# Altium project GB_EtherCan_Hardware.PrjPcb
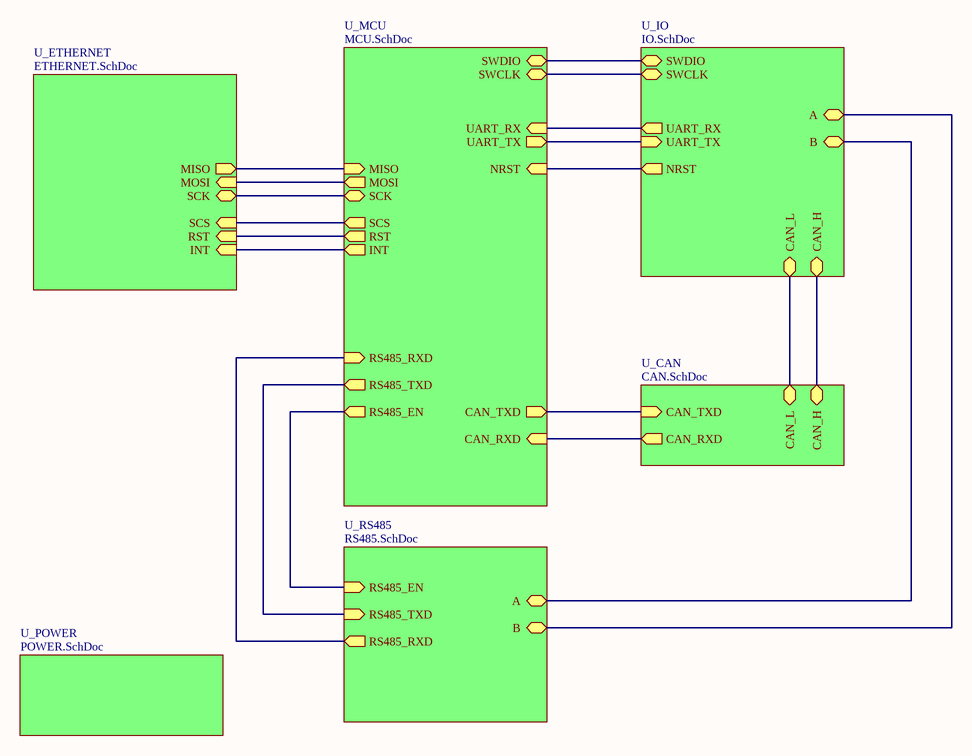
[diagram p0: Main.SchDoc]
7 sheets, 120 parts. Net scope: hierarchical (ports join the sheet entries above them; power ports are global).
Board file: GB_EtherCan.PcbDoc
Sheets:
  Main.SchDoc
    U_CAN = CAN.SchDoc
    U_MCU = MCU.SchDoc
    U_IO = IO.SchDoc
    U_ETHERNET = ETHERNET.SchDoc
    U_POWER = POWER.SchDoc
    U_RS485 = RS485.SchDoc

## Sheet Main.SchDoc
size A

### Sub-sheets
U_CAN = CAN.SchDoc: CAN_TXD (in), CAN_RXD (out), CAN_H (bidir), CAN_L (bidir)
U_ETHERNET = ETHERNET.SchDoc: RST (in), INT (in), SCS (in), SCK (bidir), MISO (out), MOSI (in)
U_IO = IO.SchDoc: SWDIO (bidir), SWCLK (bidir), UART_TX (in), UART_RX (out), CAN_H (bidir), CAN_L (bidir), NRST (out), A (bidir), B (bidir)
U_MCU = MCU.SchDoc: SWDIO (bidir), SWCLK (bidir), UART_RX (in), UART_TX (out), SCK (bidir), MISO (in), MOSI (out), SCS (out), RST (out), INT (out), CAN_TXD (out), CAN_RXD (in), NRST (in), RS485_RXD (in), RS485_TXD (out), RS485_EN (out)
U_POWER = POWER.SchDoc: no entries
U_RS485 = RS485.SchDoc: RS485_RXD (out), RS485_TXD (in), RS485_EN (in), A (bidir), B (bidir)

### Nets
A: sheet U_IO/B, sheet U_RS485/A
B: sheet U_IO/A, sheet U_RS485/B
CAN_N: sheet U_CAN/CAN_L, sheet U_IO/CAN_L
CAN_P: sheet U_CAN/CAN_H, sheet U_IO/CAN_H
CAN_RXD: sheet U_CAN/CAN_RXD, sheet U_MCU/CAN_RXD
CAN_TXD: sheet U_CAN/CAN_TXD, sheet U_MCU/CAN_TXD
JTCK SWCLK PA14: sheet U_MCU/SWCLK, sheet U_IO/SWCLK
JTMS SWDIO PA13: sheet U_MCU/SWDIO, sheet U_IO/SWDIO
NRST: sheet U_MCU/NRST, sheet U_IO/NRST
NetR17_1: sheet U_MCU/INT, sheet U_ETHERNET/INT
NetR18_1: sheet U_MCU/MOSI, sheet U_ETHERNET/MOSI
NetR19_1: sheet U_MCU/MISO, sheet U_ETHERNET/MISO
NetR23_1: sheet U_MCU/SCK, sheet U_ETHERNET/SCK
NetR24_1: sheet U_MCU/SCS, sheet U_ETHERNET/SCS
NetR41_1: sheet U_MCU/RST, sheet U_ETHERNET/RST
NetR42_1: sheet U_MCU/RS485_RXD, sheet U_RS485/RS485_RXD
NetR45_1: sheet U_MCU/RS485_EN, sheet U_RS485/RS485_EN
NetU2_4: sheet U_MCU/RS485_TXD, sheet U_RS485/RS485_TXD
NetU3_21: sheet U_MCU/UART_TX, sheet U_IO/UART_TX
NetU3_22: sheet U_MCU/UART_RX, sheet U_IO/UART_RX

## Sheet CAN.SchDoc
size A
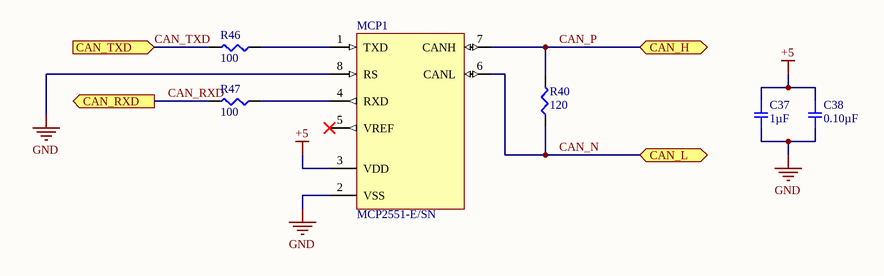
[diagram p1: CAN.SchDoc]

### Parts
C37  1µF  [0805]
C38  0.10µF  [0805]
MCP1  MCP2551-E/SN  [SOIC-SN8_N]
R40  120  [0805]
R46  100  [0805]
R47  100  [0805]

### Ports
CAN_H (bidir), CAN_L (bidir), CAN_RXD (out), CAN_TXD (in)

### Nets
+5: C37.1 C38.1 MCP1.3(VDD)
GND: C37.2 C38.2 MCP1.2(VSS) MCP1.8(RS)
CAN_N: MCP1.6(CANL) R40.1 ; port CAN_L
CAN_P: MCP1.7(CANH) R40.2 ; port CAN_H
CAN_RXD: R47.2 ; port CAN_RXD
CAN_TXD: R46.2 ; port CAN_TXD
NetMCP1_1: MCP1.1(TXD) R46.1
NetMCP1_4: MCP1.4(RXD) R47.1

Not connected (* = marked no-connect by the designer): MCP1 5(VREF)*

### Library data of the parts
C37 = GCM219R71C105KA37J: CAP CER 1.0UF 16V X7R 0805; Manufacturer: Murata Electronics North America; Factory Stock: 0; Unit Price (USD): 0.17; Minimum Quantity: 1; Tolerance: ±10%; Datasheets: http://www.murata.com/~/media/webrenewal/support/library/catalog/products/capacitor/mlcc/c03e.ashx; Image: //media.digikey.com/photos/Murata%20Photos/NCP,GCM%20SERIES%200805.jpg; Digi-Key Part Number: 490-12590-1-ND; Part Number: GCM219R71C105KA37J; Quantity Available: 7483; @ qty: 0; Packaging: Cut Tape (CT); Series: GCM; Part Status: Active; Value: 1µF; Voltage: 16V; Temperature Coefficient: X7R; Operating Temperature: -55°C ~ 125°C; Features: -; Ratings: AEC-Q200; Applications: Automotive; Mounting Type: Surface Mount, MLCC; Package / Case: 0805 (2012 Metric); Size / Dimension: 0.079" L x 0.049" W (2.00mm x 1.25mm); Height - Seated (Max): 0.037" (0.95mm); Thickness (Max): -; Lead Spacing: -
C38 = GRM219R71E104KA01D: CAP CER 0.1UF 25V X7R 0805; Manufacturer: Murata Electronics North America; Factory Stock: 0; Unit Price (USD): 0.12; Minimum Quantity: 1; Tolerance: ±10%; Datasheets: http://www.murata.com/~/media/webrenewal/support/library/catalog/products/capacitor/mlcc/c02e.pdf; Image: //media.digikey.com/Renders/Murata%20Renders/0805%20(2012%20Metric)%20.85mm.jpg; Digi-Key Part Number: 490-12754-1-ND; Part Number: GRM219R71E104KA01D; Quantity Available: 8594; @ qty: 0; Packaging: Cut Tape (CT); Series: GRM; Part Status: Active; Value: 0.10µF; Voltage: 25V; Temperature Coefficient: X7R; Operating Temperature: -55°C ~ 125°C; Features: -; Ratings: -; Applications: General Purpose; Mounting Type: Surface Mount, MLCC; Package / Case: 0805 (2012 Metric); Size / Dimension: 0.079" L x 0.049" W (2.00mm x 1.25mm); Height - Seated (Max): -; Thickness (Max): 0.037" (0.95mm); Lead Spacing: -; Lead Style: -
MCP1 = MCP2551-E/SN: High-Speed CAN Transceiver, 8-Pin SOIC, Extended Temperature; Manufacturer: Microchip; DatasheetVersion: revF, Jul-2010; PackageVersion: revBB, Aug-2009; PackageReference: SOIC-SN8; PackageDescription: 8-Lead Plastic Small Outline (SN) - Narrow, 3.90mm Body [SOIC]; Supplier 1: Digi-Key; Supplier Part Number 1: MCP2551-E/SN-ND; Supplier 2: Farnell; Supplier Part Number 2: 1467746; Supplier 3: Newark; Supplier Part Number 3: 92C4186; Supplier 4: Mouser; Supplier Part Number 4: 579-MCP2551-E/SN; Mounting Technology: Surface Mount; Code_JEDEC: MS-012; Code_IPC: SOIC127P600-8; PartNumber: MCP2551-E/SN; ComponentLink1Description: Manufacturer URL; ComponentLink1URL: http://www.microchip.com/; ComponentLink2Description: Datasheet; ComponentLink2URL: http://ww1.microchip.com/downloads/en/DeviceDoc/21667F.pdf; ComponentLink3Description: Package Specification; ComponentLink3URL: http://www.microchip.com/stellent/groups/techpub_sg/documents/packagingspec/en012702.pdf
R40 = ERJ-6GEYJ121V: RES SMD 120 OHM 5% 1/8W 0805; Manufacturer: Panasonic Electronic Components; Factory Stock: 0; Unit Price (USD): 0.00496; @ qty: 1500; Minimum Quantity: 1; Power (Watts): 0.125W, 1/8W; Temperature Coefficient: ±200ppm/°C; Part Number: ERJ-6GEYJ121V; Datasheets: http://industrial.panasonic.com/www-cgi/jvcr13pz.cgi?E+PZ+3+AOA0001+ERJ6GEYJ121V+7+WW; Image: //media.digikey.com/Renders/Panasonic%20Renders/ERJ-0805%20Pkg.jpg; Digi-Key Part Number: P120ACT-ND; Quantity Available: 58156; Packaging: Cut Tape (CT); Series: ERJ; Part Status: Active; Value: 120; Tolerance: ±5%; Composition: Thick Film; Features: Automotive AEC-Q200; Operating Temperature: -55°C ~ 155°C; Package / Case: 0805 (2012 Metric); Supplier Device Package: 0805; Size / Dimension: 0.079" L x 0.049" W (2.00mm x 1.25mm); Height - Seated (Max): 0.028" (0.70mm); Number of Terminations: 2; Failure Rate: -
R46 R47 = ERJ-6GEYJ121V: RES SMD 120 OHM 5% 1/8W 0805; Manufacturer: Panasonic Electronic Components; Factory Stock: 0; Unit Price (USD): 0.00496; @ qty: 1500; Minimum Quantity: 1; Value: 120; Power (Watts): 0.125W, 1/8W; Temperature Coefficient: ±200ppm/°C; Part Number: ERJ-6GEYJ121V; Datasheets: http://industrial.panasonic.com/www-cgi/jvcr13pz.cgi?E+PZ+3+AOA0001+ERJ6GEYJ121V+7+WW; Image: //media.digikey.com/Renders/Panasonic%20Renders/ERJ-0805%20Pkg.jpg; Digi-Key Part Number: P120ACT-ND; Quantity Available: 58156; Packaging: Cut Tape (CT); Series: ERJ; Part Status: Active; Tolerance: ±5%; Composition: Thick Film; Features: Automotive AEC-Q200; Operating Temperature: -55°C ~ 155°C; Package / Case: 0805 (2012 Metric); Supplier Device Package: 0805; Size / Dimension: 0.079" L x 0.049" W (2.00mm x 1.25mm); Height - Seated (Max): 0.028" (0.70mm); Number of Terminations: 2; Failure Rate: -

## Sheet MCU.SchDoc
size A
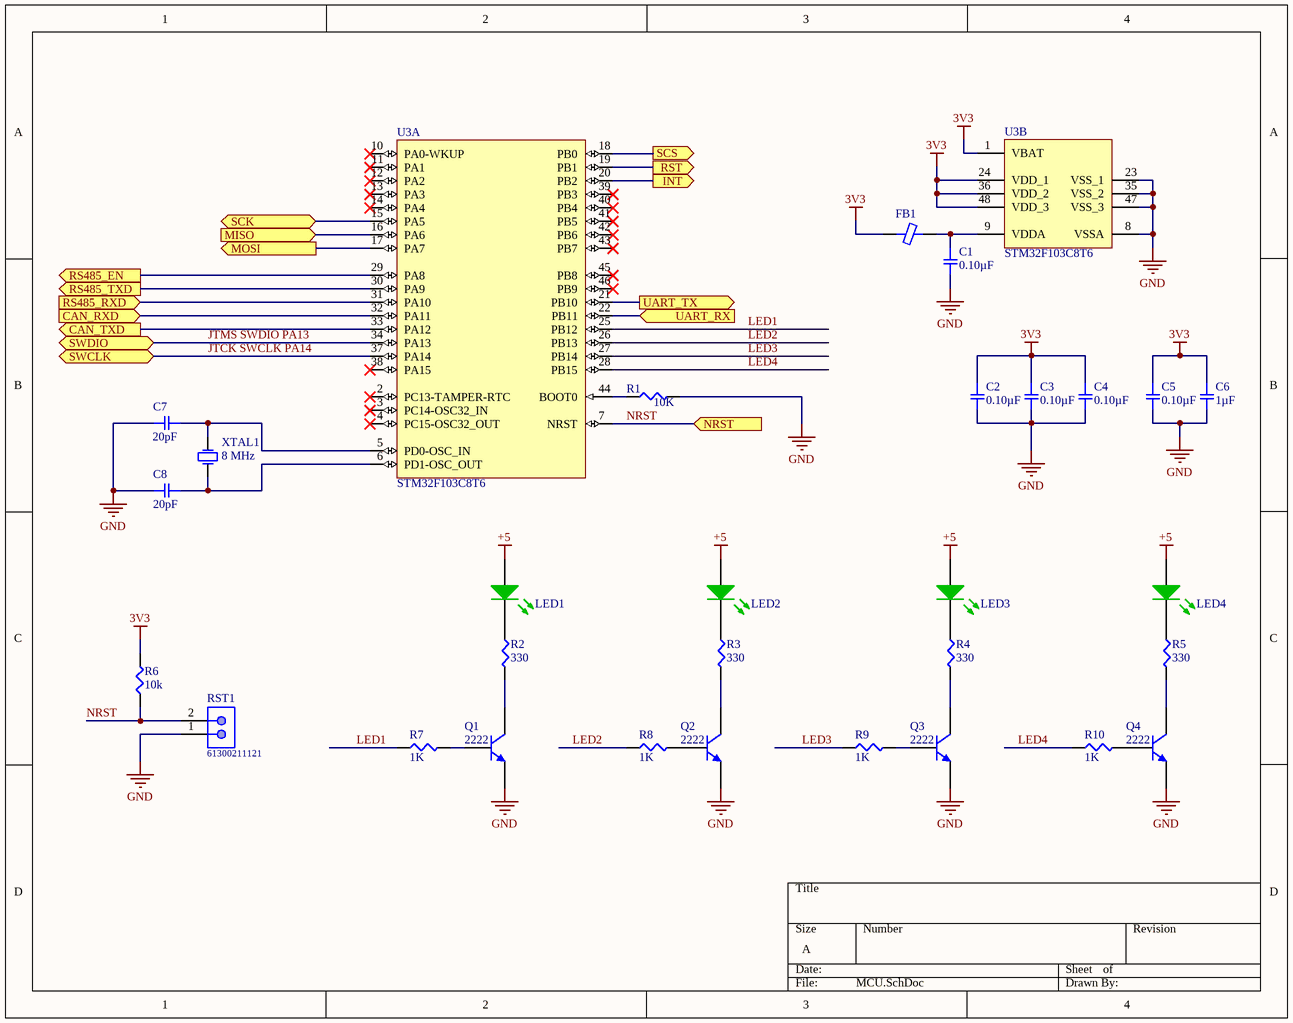
[diagram p2: MCU.SchDoc]

### Parts
C1  0.10µF  [0805]
C2  0.10µF  [0805]
C3  0.10µF  [0805]
C4  0.10µF  [0805]
C5  0.10µF  [0805]
C6  1µF  [0805]
C7  20pF  [0805]
C8  20pF  [0805]
FB1  (no value)  [0805]
LED1  LED-GREEN  [DIOSMD1206]  (value not drawn)
LED2  LED-GREEN  [DIOSMD1206]  (value not drawn)
LED3  LED-GREEN  [DIOSMD1206]  (value not drawn)
LED4  LED-GREEN  [DIOSMD1206]  (value not drawn)
Q1  2222  [SOT23-3]
Q2  2222  [SOT23-3]
Q3  2222  [SOT23-3]
Q4  2222  [SOT23-3]
R1  10K  [0805]
R2  330  [0805]
R3  330  [0805]
R4  330  [0805]
R5  330  [0805]
R6  10k  [0805]
R7  1K  [0805]
R8  1K  [0805]
R9  1K  [0805]
R10  1K  [0805]
RST1  61300211121  [61300211121]
U3  STM32F103C8T6  [STM-LQFP48_N]  (parts A,B of 2)
XTAL1  8 MHz  [CRYSTAL Small]

### Ports
CAN_RXD (in), CAN_TXD (out), INT (out), MISO (in), MOSI (out), NRST (in), RS485_EN (out), RS485_RXD (in), RS485_TXD (out), RST (out), SCK (bidir), SCS (out), SWCLK (bidir), SWDIO (bidir), UART_RX (in), UART_TX (out)

### Nets
3V3: C2.1 C3.1 C4.1 C5.1 C6.1 FB1.1 R6.2 U3.1(VBAT) U3.24(VDD_1) U3.36(VDD_2) U3.48(VDD_3)
+5: LED1.1(A) LED2.1(A) LED3.1(A) LED4.1(A)
GND: C1.2 C2.2 C3.2 C4.2 C5.2 C6.2 C7.2 C8.2 Q1.2(E) Q2.2(E) Q3.2(E) Q4.2(E) R1.2 RST1.1 U3.8(VSSA) U3.23(VSS_1) U3.35(VSS_2) U3.47(VSS_3)
CAN_RXD: U3.32(PA11) ; port CAN_RXD
CAN_TXD: U3.33(PA12) ; port CAN_TXD
JTCK SWCLK PA14: U3.37(PA14) ; port SWCLK
JTMS SWDIO PA13: U3.34(PA13) ; port SWDIO
LED1: R7.1 U3.25(PB12)
LED2: R8.1 U3.26(PB13)
LED3: R9.1 U3.27(PB14)
LED4: R10.1 U3.28(PB15)
NRST: R6.1 RST1.2 U3.7(NRST) ; port NRST
NetC1_1: C1.1 FB1.2 U3.9(VDDA)
NetC7_1: C7.1 U3.5(PD0-OSC_IN) XTAL1.2(OSC2)
NetC8_1: C8.1 U3.6(PD1-OSC_OUT) XTAL1.1(OSC1)
NetLED1_2: LED1.2(K) R2.1
NetLED2_2: LED2.2(K) R3.1
NetLED3_2: LED3.2(K) R4.1
NetLED4_2: LED4.2(K) R5.1
NetQ1_1: Q1.1(B) R7.2
NetQ1_3: Q1.3(C) R2.2
NetQ2_1: Q2.1(B) R8.2
NetQ2_3: Q2.3(C) R3.2
NetQ3_1: Q3.1(B) R9.2
NetQ3_3: Q3.3(C) R4.2
NetQ4_1: Q4.1(B) R10.2
NetQ4_3: Q4.3(C) R5.2
NetR1_1: R1.1 U3.44(BOOT0)
NetR17_1: U3.20(PB2) ; port INT
NetR18_1: U3.17(PA7) ; port MOSI
NetR19_1: U3.16(PA6) ; port MISO
NetR23_1: U3.15(PA5) ; port SCK
NetR24_1: U3.18(PB0) ; port SCS
NetR41_1: U3.19(PB1) ; port RST
NetR42_1: U3.31(PA10) ; port RS485_RXD
NetR45_1: U3.29(PA8) ; port RS485_EN
NetU2_4: U3.30(PA9) ; port RS485_TXD
NetU3_21: U3.21(PB10) ; port UART_TX
NetU3_22: U3.22(PB11) ; port UART_RX

Not connected (* = marked no-connect by the designer): U3 2(PC13-TAMPER-RTC)* 3(PC14-OSC32_IN)* 4(PC15-OSC32_OUT)* 10(PA0-WKUP)* 11(PA1)* 12(PA2)* 13(PA3)* 14(PA4)* 38(PA15)* 39(PB3)* 40(PB4)* 41(PB5)* 42(PB6)* 43(PB7)* 45(PB8)* 46(PB9)*

### Library data of the parts
C1-C5 = GRM219R71E104KA01D: as C38 on sheet CAN; Datasheets: http://www.murata.com/~/media/webrenewal/support/library/catalog/products/capacitor/mlcc/c02e.pdf; Image: //media.digikey.com/Renders/Murata%20Renders/0805%20(2012%20Metric)%20.85mm.jpg; Digi-Key Part Number: 490-12754-1-ND; Part Number: GRM219R71E104KA01D; Quantity Available: 8594; @ qty: 0; Packaging: Cut Tape (CT); Series: GRM; Part Status: Active; Value: 0.10µF; Voltage: 25V; Temperature Coefficient: X7R; Operating Temperature: -55°C ~ 125°C; Features: -; Ratings: -; Applications: General Purpose; Mounting Type: Surface Mount, MLCC; Package / Case: 0805 (2012 Metric); Size / Dimension: 0.079" L x 0.049" W (2.00mm x 1.25mm); Height - Seated (Max): -; Thickness (Max): 0.037" (0.95mm); Lead Spacing: -; Lead Style: -
C6 = GCM219R71C105KA37J: as C37 on sheet CAN; Datasheets: http://www.murata.com/~/media/webrenewal/support/library/catalog/products/capacitor/mlcc/c03e.ashx; Image: //media.digikey.com/photos/Murata%20Photos/NCP,GCM%20SERIES%200805.jpg; Digi-Key Part Number: 490-12590-1-ND; Part Number: GCM219R71C105KA37J; Quantity Available: 7483; @ qty: 0; Packaging: Cut Tape (CT); Series: GCM; Part Status: Active; Value: 1µF; Voltage: 16V; Temperature Coefficient: X7R; Operating Temperature: -55°C ~ 125°C; Features: -; Ratings: AEC-Q200; Applications: Automotive; Mounting Type: Surface Mount, MLCC; Package / Case: 0805 (2012 Metric); Size / Dimension: 0.079" L x 0.049" W (2.00mm x 1.25mm); Height - Seated (Max): 0.037" (0.95mm); Thickness (Max): -; Lead Spacing: -
C7 C8 = GQM2195C1H200JB01D: CAP CER 20PF 50V NP0 0805; Manufacturer: Murata Electronics North America; Factory Stock: 0; Unit Price (USD): 0.78; Minimum Quantity: 1; Tolerance: ±5%; Temperature Coefficient: C0G, NP0; Datasheets: http://www.murata.com/~/media/webrenewal/support/library/catalog/products/capacitor/mlcc/c02e.pdf; Image: //media.digikey.com/Renders/Murata%20Renders/0805(GxM9).jpg; Digi-Key Part Number: 490-3607-1-ND; Part Number: GQM2195C1H200JB01D; Quantity Available: 270; @ qty: 0; Packaging: Cut Tape (CT); Series: GQM; Part Status: Active; Value: 20pF; Voltage: 50V; Operating Temperature: -55°C ~ 125°C; Features: High Q, Low Loss; Ratings: -; Applications: RF, Microwave, High Frequency; Mounting Type: Surface Mount, MLCC; Package / Case: 0805 (2012 Metric); Size / Dimension: 0.079" L x 0.049" W (2.00mm x 1.25mm); Height - Seated (Max): -; Thickness (Max): 0.037" (0.95mm); Lead Spacing: -; Lead Style: -
FB1 = 2508053007Y3: FERRITE BEAD 0805 1LN; Manufacturer: Fair-Rite Products Corp.; Current Rating (Max): 3A; DC Resistance (DCR) (Max): 30mOhm; Filter Type: Signal Line; Number of Lines: 1; Part Number: 2508053007Y3; ComponentLink1Description: Datasheet; ComponentLink1URL: http://www.fair-rite.com/wp-content/themes/fair-rite/print_product.php?pid=19169; ComponentLink2Description: DigiKey Link; ComponentLink2URL: http://digikey.com/product-detail/en/fair-rite-products-corp/2508053007Y3/1934-1399-1-ND/8594366; Device Package: 0805 (2012 Metric); Height (Max): 0.043" (1.10mm); LastUpdated: 1/21/2020 2:29:10 AM; Lifecycle Status: Active; Minimum Order: 1; Mounting Type: Surface Mount; Operating Temperature: -55°C ~ 125°C; Package / Case: 0805 (2012 Metric); Packaging: TapeAndReel; PartId: 1487; Part Status: Active; Price: 0.02; Series: -; Size / Dimension: 0.079" L x 0.049" W (2.00mm x 1.25mm); Supplier 1: DigiKey; Supplier Part Number 1: 1934-1399-1-ND
LED1-LED4 = LED-GREEN: General Propuse Ga/As LED; Supplier 1: Newark; Supplier 2: Digi-Key; Supplier 3: Mouser; Supplier 4: Farnell; Supplier 5: Mouser; Supplier Part Number 1: 95W3800; Supplier Part Number 2: 160-1423-6-ND; Supplier Part Number 3: 630-HSMM-C170; Supplier Part Number 4: 2322076; Supplier Part Number 5: 604-APT2012SGC
Q1-Q4 = BC817-25: NPN General Purpose Amplifier; Published: 8-Jun-2000; LatestRevisionDate: 20-Nov-2009; LatestRevisionNote: IPC-7351 Footprint Added.; DatasheetVersion: 1997; PackageVersion: Sep-1998; PackageReference: SOT-23A; Publisher: Altium Limited; PackageDescription: 3-Pin SOT-23 Package 0.95 mm Pitch, 2.3 mm Lead Span; ComponentLink1Description: Manufacturer Link; ComponentLink1URL: http://www.fairchildsemi.com/; ComponentLink2Description: Discontinuation Notice; ComponentLink2URL: http://www.fairchildsemi.com/obsolete/obs.jsp; Supplier 1: Mouser; Supplier 2: Digi-Key; Supplier Part Number 1: 863-BC817-25LT1G; Supplier Part Number 2: BC817-25-TPMSDKR-ND
R1 R6 = ERJ-6GEYJ103V: RES SMD 10K OHM 5% 1/8W 0805; Manufacturer: Panasonic Electronic Components; Factory Stock: 0; Unit Price (USD): 0.00496; @ qty: 1500; Minimum Quantity: 1; Power (Watts): 0.125W, 1/8W; Temperature Coefficient: ±200ppm/°C; Part Number: ERJ-6GEYJ103V; Datasheets: http://industrial.panasonic.com/www-cgi/jvcr13pz.cgi?E+PZ+3+AOA0001+ERJ6GEYJ103V+7+WW; Image: //media.digikey.com/Renders/Panasonic%20Renders/ERJ-0805%20Pkg.jpg; Digi-Key Part Number: P10KACT-ND; Quantity Available: 2328224; Packaging: Cut Tape (CT); Series: ERJ; Part Status: Active; Value: 10k; Tolerance: ±5%; Composition: Thick Film; Features: Automotive AEC-Q200; Operating Temperature: -55°C ~ 155°C; Package / Case: 0805 (2012 Metric); Supplier Device Package: 0805; Size / Dimension: 0.079" L x 0.049" W (2.00mm x 1.25mm); Height - Seated (Max): 0.028" (0.70mm); Number of Terminations: 2; Failure Rate: -
R2-R5 = ERJ-6GEYJ331V: RES SMD 330 OHM 5% 1/8W 0805; Manufacturer: Panasonic Electronic Components; Factory Stock: 0; Unit Price (USD): 0.00496; @ qty: 1500; Minimum Quantity: 1; Power (Watts): 0.125W, 1/8W; Temperature Coefficient: ±200ppm/°C; Part Number: ERJ-6GEYJ331V; Datasheets: http://industrial.panasonic.com/www-cgi/jvcr13pz.cgi?E+PZ+3+AOA0001+ERJ6GEYJ331V+7+WW; Image: //media.digikey.com/Renders/Panasonic%20Renders/ERJ-0805%20Pkg.jpg; Digi-Key Part Number: P330ACT-ND; Quantity Available: 212236; Packaging: Cut Tape (CT); Series: ERJ; Part Status: Active; Value: 330; Tolerance: ±5%; Composition: Thick Film; Features: Automotive AEC-Q200; Operating Temperature: -55°C ~ 155°C; Package / Case: 0805 (2012 Metric); Supplier Device Package: 0805; Size / Dimension: 0.079" L x 0.049" W (2.00mm x 1.25mm); Height - Seated (Max): 0.028" (0.70mm); Number of Terminations: 2; Failure Rate: -
R7-R10 = ERJ-6GEYJ331V: RES SMD 330 OHM 5% 1/8W 0805; Manufacturer: Panasonic Electronic Components; Factory Stock: 0; Unit Price (USD): 0.00496; @ qty: 1500; Minimum Quantity: 1; Value: 330; Power (Watts): 0.125W, 1/8W; Temperature Coefficient: ±200ppm/°C; Part Number: ERJ-6GEYJ331V; Datasheets: http://industrial.panasonic.com/www-cgi/jvcr13pz.cgi?E+PZ+3+AOA0001+ERJ6GEYJ331V+7+WW; Image: //media.digikey.com/Renders/Panasonic%20Renders/ERJ-0805%20Pkg.jpg; Digi-Key Part Number: P330ACT-ND; Quantity Available: 212236; Packaging: Cut Tape (CT); Series: ERJ; Part Status: Active; Tolerance: ±5%; Composition: Thick Film; Features: Automotive AEC-Q200; Operating Temperature: -55°C ~ 155°C; Package / Case: 0805 (2012 Metric); Supplier Device Package: 0805; Size / Dimension: 0.079" L x 0.049" W (2.00mm x 1.25mm); Height - Seated (Max): 0.028" (0.70mm); Number of Terminations: 2; Failure Rate: -
RST1 = 61300211121: WR-PHD Pin Header, THT, pitch 2.54mm, Single Row, Vertical, 2pin; Pin Number: 2; Gender: Male; Rated Current: 3A; Working Voltage: 250VAC; Withstanding Voltage: 500VAC; Contact Resistance: 20mOhm; ComponentLink1Description: Manufacturer; ComponentLink1URL: http://www.we-online.de; ComponentLink2Description: Datasheet; ComponentLink2URL: https://katalog.we-online.de/em/datasheet/6130xx11121.pdf; Part Number: 61300211121; Published Date: June 2019; Publisher: Wurth Elektronik; Pitch: 2.54mm; Operating Temperature: -40 to +105degC; Mounting Technology: THT; Packaging: Bag; Row Number: Single; Orientation: Vertical
U3 = STM32F103C8T6: ARM Cortex-M3 32-bit MCU, 64 KB Flash, 20 KB Internal RAM, 37 I/Os, 48-pin LQFP, -40 to 85 degC, Tray; A/D Converter: 2x12-bit (10 Channel); FLASH Size (Prog) (kB): 64; I/Os (High Current): 37; Internal RAM Size (kB): 20; Operating Frequency(F) (Processor speed) (MHz): 72; Supply Voltage(Vcc) min (V): 2; DatasheetVersion: Rev. 16; PackageVersion: Rev. 6, 06/2013; PackageReference: LQFP48; PackageDescription: 48-Pin Low Profile Quad Flat Package, 7 x 7 mm Body, 0.5 mm Pitch; Supplier 1: Digi-Key; Supplier Part Number 1: 497-6063-ND; Supplier 2: Farnell; Supplier Part Number 2: 1447637; Supplier 3: Newark; Supplier Part Number 3: 59M2182; Supplier 4: Newark; Supplier Part Number 4: 57P1222; Supplier 5: Mouser; Supplier Part Number 5: 511-STM32F103C8T6; Core: ARM Cortex-M3; Packing: Tray; Mounting Technology: Surface Mount; PartNumber: STM32F103C8T6; ComponentLink1Description: Manufacturer URL; ComponentLink1URL: http://www.st.com/web/en/home.html; ComponentLink2Description: Datasheet; ComponentLink2URL: http://www.st.com/st-web-ui/static/active/en/resource/technical/document/datasheet/CD00161566.pdf; ComponentLink3Description: Package Specification; ComponentLink3URL: http://www.st.com/st-web-ui/static/active/en/resource/technical/document/datasheet/DM00058181.pdf
XTAL1 = XTAL: XTAL Crystal; Designer: ABBAS BASEREH; Value: 12 MHz; Design Date: 2017-1-3; ComponentLink1Description: Datasheet; ComponentLink2Description: Reference; Mounting Technology: Surface Mount\Through-Hole; Status: Unreleased

## Sheet IO.SchDoc
size A
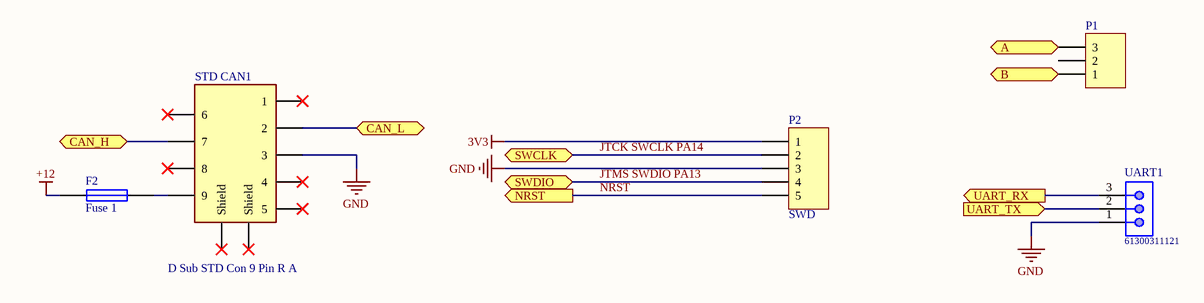
[diagram p3: IO.SchDoc]

### Parts
F2  Fuse 1  [3216[1206]]
P1  (no value)  [B3B-XH-A]
P2  SWD  [B5B-XH-A]
STD_CAN1  D Sub STD Con 9 Pin R A  [D Sub STD Con 9 Pin R A]
UART1  61300311121  [61300311121]

### Ports
A (bidir), B (bidir), CAN_H (bidir), CAN_L (bidir), NRST (out), SWCLK (bidir), SWDIO (bidir), UART_RX (out), UART_TX (in)

### Nets
3V3: P2.1
+12: F2.1
GND: P2.3 STD_CAN1.3 UART1.1
A: P1.1 ; port B
B: P1.3 ; port A
CAN_N: STD_CAN1.2 ; port CAN_L
CAN_P: STD_CAN1.7 ; port CAN_H
JTCK SWCLK PA14: P2.2 ; port SWCLK
JTMS SWDIO PA13: P2.4 ; port SWDIO
NRST: P2.5 ; port NRST
NetF2_2: F2.2 STD_CAN1.9
NetU3_21: UART1.2 ; port UART_TX
NetU3_22: UART1.3 ; port UART_RX

Not connected (* = marked no-connect by the designer): P1 2; STD_CAN1 1* 4* 5* 6* 8* 10(Shield)* 11(Shield)*

### Library data of the parts
F2 = Fuse 1: Fuse; Published: 8-Jun-2000; LatestRevisionDate: 17-Jul-2002; LatestRevisionNote: Re-released for DXP Platform.; PackageReference: PIN-W2/E2.8; Publisher: Altium Limited; PackageDescription: Thru-Hole; 2 Leads
P1 = Header 3: Header, 3-Pin; LatestRevisionDate: 17-Jul-2002; LatestRevisionNote: Re-released for DXP Platform.; Publisher: Altium Limited
P2 = Header 5: Header, 5-Pin; LatestRevisionDate: 17-Jul-2002; LatestRevisionNote: Re-released for DXP Platform.; Publisher: Altium Limited
UART1 = 61300311121: WR-PHD Pin Header, THT, pitch 2.54mm, Single Row, Vertical, 3pin; Pin Number: 3; Gender: Male; Rated Current: 3A; Working Voltage: 250VAC; Withstanding Voltage: 500VAC; Contact Resistance: 20mOhm; ComponentLink1Description: Manufacturer; ComponentLink1URL: http://www.we-online.de; ComponentLink2Description: Datasheet; ComponentLink2URL: https://katalog.we-online.de/em/datasheet/6130xx11121.pdf; Part Number: 61300311121; Published Date: June 2019; Publisher: Wurth Elektronik; Pitch: 2.54mm; Operating Temperature: -40 to +105degC; Mounting Technology: THT; Packaging: Bag; Row Number: Single; Orientation: Vertical

## Sheet ETHERNET.SchDoc
size A
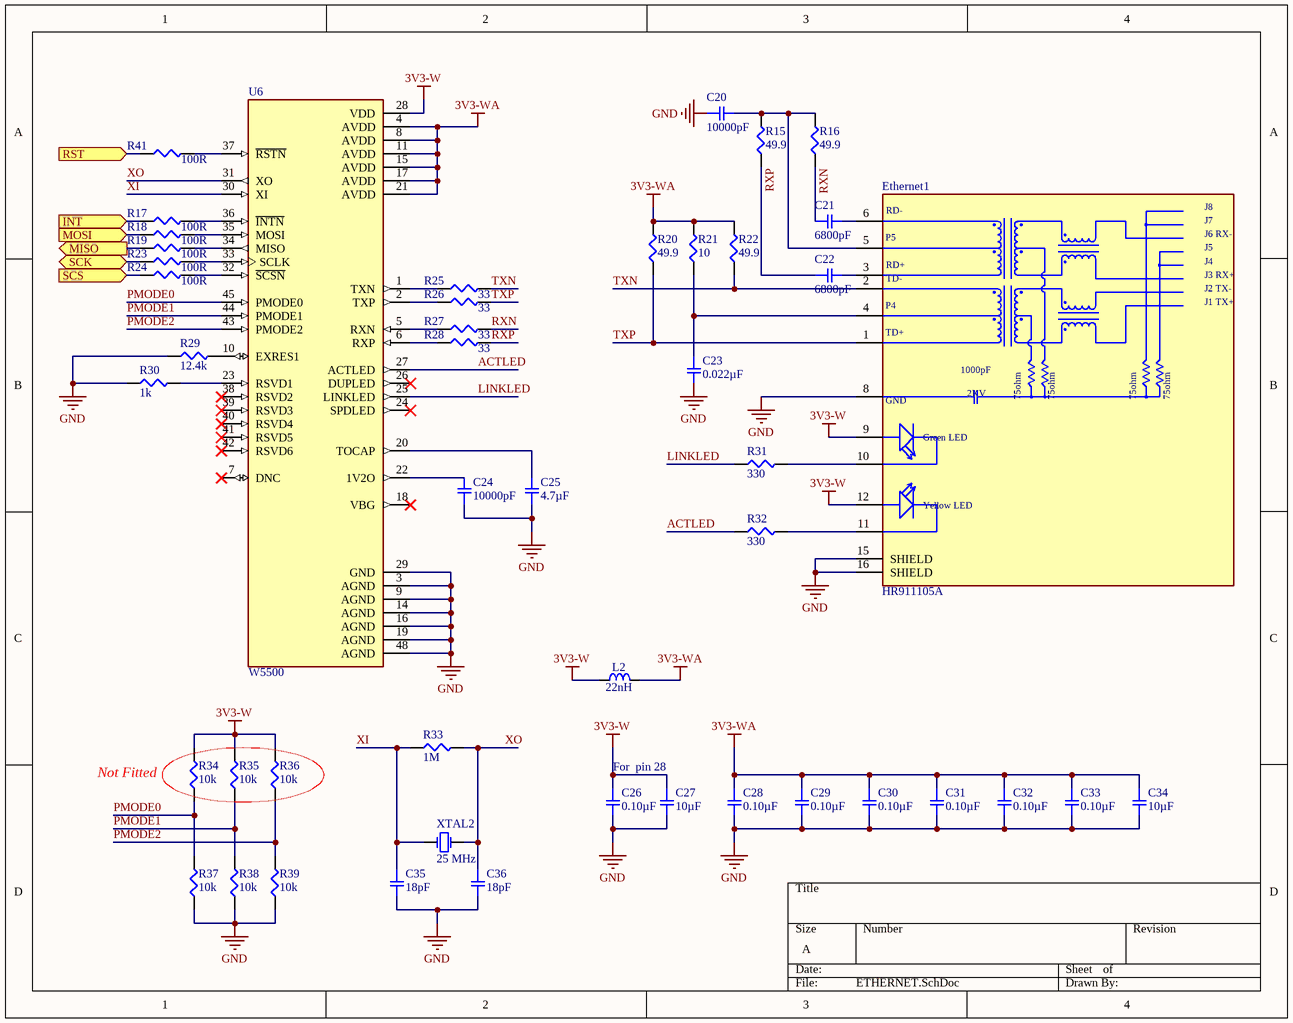
[diagram p4: ETHERNET.SchDoc]

### Parts
C20  10000pF  [0805]
C21  6800pF  [0805]
C22  6800pF  [0805]
C23  0.022µF  [0805]
C24  10000pF  [0805]
C25  4.7µF  [0805]
C26  0.10µF  [0805]
C27  10µF  [0805]
C28  0.10µF  [0805]
C29  0.10µF  [0805]
C30  0.10µF  [0805]
C31  0.10µF  [0805]
C32  0.10µF  [0805]
C33  0.10µF  [0805]
C34  10µF  [0805]
C35  18pF  [0805]
C36  18pF  [0805]
Ethernet1  HR911105A  [HANRUN_HR911105A]
L2  22nH  [0805]
R15  49.9  [0805]
R16  49.9  [0805]
R17  100R  [0805]
R18  100R  [0805]
R19  100R  [0805]
R20  49.9  [0805]
R21  10  [0805]
R22  49.9  [0805]
R23  100R  [0805]
R24  100R  [0805]
R25  33  [0805]
R26  33  [0805]
R27  33  [0805]
R28  33  [0805]
R29  12.4k  [0805]
R30  1k  [0805]
R31  330  [0805]
R32  330  [0805]
R33  1M  [0805]
R34  10k  [0805]
R35  10k  [0805]
R36  10k  [0805]
R37  10k  [0805]
R38  10k  [0805]
R39  10k  [0805]
R41  100R  [0805]
U6  W5500  [QFP50P900X900X160-48N]
XTAL2  25 MHz  [CRYSTAL Small]

### Ports
INT (in), MISO (out), MOSI (in), RST (in), SCK (bidir), SCS (in)

### Nets
3V3-W: C26.1 C27.1 Ethernet1.9(GA) Ethernet1.12(YA) L2.1 R34.2 R35.2 R36.2 U6.28(VDD)
3V3-WA: C28.1 C29.1 C30.1 C31.1 C32.1 C33.1 C34.1 L2.2 R20.2 R21.2 R22.2 U6.4(AVDD) U6.8(AVDD) U6.11(AVDD) U6.15(AVDD) U6.17(AVDD) U6.21(AVDD)
GND: C20.1 C23.2 C24.1 C25.1 C26.2 C27.2 C28.2 C29.2 C30.2 C31.2 C32.2 C33.2 C34.2 C35.2 C36.2 Ethernet1.8(GND) Ethernet1.15(SHIELD) Ethernet1.16(SHIELD) R29.1 R30.1 R37.1 R38.1 R39.1 U6.3(AGND) U6.9(AGND) U6.14(AGND) U6.16(AGND) U6.19(AGND) U6.29(GND) U6.48(AGND)
ACTLED: R32.1 U6.27(ACTLED)
LINKLED: R31.1 U6.25(LINKLED)
PMODE0: R34.1 R37.2 U6.45(PMODE0)
PMODE1: R35.1 R38.2 U6.44(PMODE1)
PMODE2: R36.1 R39.2 U6.43(PMODE2)
RXN: C21.1 R16.1 R27.2
RXP: C22.1 R15.1 R28.2
TXN: Ethernet1.2(TD-) R22.1 R25.2
TXP: Ethernet1.1(TD+) R20.1 R26.2
XI: C35.1 R33.1 U6.30(XI) XTAL2.2(OSC2)
XO: C36.1 R33.2 U6.31(XO) XTAL2.1(OSC1)
NetC20_2: C20.2 Ethernet1.5(P5) R15.2 R16.2
NetC21_2: C21.2 Ethernet1.6(RD-)
NetC22_2: C22.2 Ethernet1.3(RD+)
NetC23_1: C23.1 Ethernet1.4(P4) R21.1
NetC24_2: C24.2 U6.22(1V2O)
NetC25_2: C25.2 U6.20(TOCAP)
NetEthernet1_10: Ethernet1.10(GC) R31.2
NetEthernet1_11: Ethernet1.11(YC) R32.2
NetR17_1: R17.1 ; port INT
NetR17_2: R17.2 U6.36(~{INTN})
NetR18_1: R18.1 ; port MOSI
NetR18_2: R18.2 U6.35(MOSI)
NetR19_1: R19.1 ; port MISO
NetR19_2: R19.2 U6.34(MISO)
NetR23_1: R23.1 ; port SCK
NetR23_2: R23.2 U6.33(SCLK)
NetR24_1: R24.1 ; port SCS
NetR24_2: R24.2 U6.32(~{SCSN})
NetR25_1: R25.1 U6.1(TXN)
NetR26_1: R26.1 U6.2(TXP)
NetR27_1: R27.1 U6.5(RXN)
NetR28_1: R28.1 U6.6(RXP)
NetR29_2: R29.2 U6.10(EXRES1)
NetR30_2: R30.2 U6.23(RSVD1)
NetR41_1: R41.1 ; port RST
NetR41_2: R41.2 U6.37(~{RSTN})

Not connected (* = marked no-connect by the designer): U6 7(DNC)* 18(VBG)* 24(SPDLED)* 26(DUPLED)* 38(RSVD2)* 39(RSVD3)* 40(RSVD4)* 41(RSVD5)* 42(RSVD6)*

### Notes on the sheet
- (near R34) Not Fitted
- For  pin 28
- (in symbol HR911105A) J8; J7; J6 RX-; J5; J4; J3 RX+; J2 TX-; J1 TX+; 1000pF; 2KV; 75ohm; Green LED; Yellow LED

### Library data of the parts
C20 C24 = GC321AD72E103KX01D: CAP CER 10000PF 250V X7T 0805; Manufacturer: Murata Electronics North America; Factory Stock: 0; Unit Price (USD): 0.3; Minimum Quantity: 1; Tolerance: ±10%; Datasheets: http://search.murata.co.jp/Ceramy/image/img/A01X/G101/ENG/GC321AD72E103KX01-01.pdf; Image: //media.digikey.com/Renders/Murata%20Renders/0805(GC3)200x125.jpg; Digi-Key Part Number: 490-13986-1-ND; Part Number: GC321AD72E103KX01D; Quantity Available: 4000; @ qty: 0; Packaging: Cut Tape (CT); Series: GC3; Part Status: Active; Value: 10000pF; Voltage: 250V; Temperature Coefficient: X7T; Operating Temperature: -55°C ~ 125°C; Features: -; Ratings: AEC-Q200; Applications: Automotive; Mounting Type: Surface Mount, MLCC; Package / Case: 0805 (2012 Metric); Size / Dimension: 0.079" L x 0.049" W (2.00mm x 1.25mm); Height - Seated (Max): -; Thickness (Max): 0.039" (1.00mm); Lead Spacing: -; Lead Style: -
C21 C22 = GCJ216R71H682KA01D: CAP CER 6800PF 50V X7R 0805; Manufacturer: Murata Electronics North America; Factory Stock: 0; Unit Price (USD): 0.26; Minimum Quantity: 1; Tolerance: ±10%; Datasheets: http://www.murata.com/~/media/webrenewal/support/library/catalog/products/capacitor/mlcc/c03e.ashx; Image: //media.digikey.com/Renders/Murata%20Renders/0805%20(2012%20Metric)%20.85mm.jpg; Digi-Key Part Number: 490-5853-1-ND; Part Number: GCJ216R71H682KA01D; Quantity Available: 4272; @ qty: 0; Packaging: Cut Tape (CT); Series: GCJ; Part Status: Active; Value: 6800pF; Voltage: 50V; Temperature Coefficient: X7R; Operating Temperature: -55°C ~ 125°C; Features: Soft Termination; Ratings: AEC-Q200; Applications: Automotive, Boardflex Sensitive; Mounting Type: Surface Mount, MLCC; Package / Case: 0805 (2012 Metric); Size / Dimension: 0.079" L x 0.049" W (2.00mm x 1.25mm); Height - Seated (Max): -; Thickness (Max): 0.024" (0.60mm); Lead Spacing: -; Lead Style: -
C23 = GCJ216R71H223KA01D: CAP CER 0.022UF 50V X7R 0805; Manufacturer: Murata Electronics North America; Factory Stock: 0; Unit Price (USD): 0.26; Minimum Quantity: 1; Tolerance: ±10%; Datasheets: http://www.murata.com/~/media/webrenewal/support/library/catalog/products/capacitor/mlcc/c03e.ashx; Image: //media.digikey.com/Renders/Murata%20Renders/0805%20(2012%20Metric)%20.85mm.jpg; Digi-Key Part Number: 490-5842-1-ND; Part Number: GCJ216R71H223KA01D; Quantity Available: 14505; @ qty: 0; Packaging: Cut Tape (CT); Series: GCJ; Part Status: Active; Value: 0.022µF; Voltage: 50V; Temperature Coefficient: X7R; Operating Temperature: -55°C ~ 125°C; Features: Soft Termination; Ratings: AEC-Q200; Applications: Automotive, Boardflex Sensitive; Mounting Type: Surface Mount, MLCC; Package / Case: 0805 (2012 Metric); Size / Dimension: 0.079" L x 0.049" W (2.00mm x 1.25mm); Height - Seated (Max): -; Thickness (Max): 0.024" (0.60mm); Lead Spacing: -; Lead Style: -
C25 = GCM21BC71A475KA73L: CAP CER 4.7UF 10V X7S 0805; Manufacturer: Murata Electronics North America; Factory Stock: 0; Unit Price (USD): 0.58; Minimum Quantity: 1; Tolerance: ±10%; Datasheets: http://www.murata.com/~/media/webrenewal/support/library/catalog/products/capacitor/mlcc/c03e.ashx; Image: //media.digikey.com/photos/Murata%20Photos/NCP,GCM%20SERIES%200805.jpg; Digi-Key Part Number: 490-6062-1-ND; Part Number: GCM21BC71A475KA73L; Quantity Available: 9218; @ qty: 0; Packaging: Cut Tape (CT); Series: GCM; Part Status: Active; Value: 4.7µF; Voltage: 10V; Temperature Coefficient: X7S; Operating Temperature: -55°C ~ 125°C; Features: -; Ratings: AEC-Q200; Applications: Automotive; Mounting Type: Surface Mount, MLCC; Package / Case: 0805 (2012 Metric); Size / Dimension: 0.079" L x 0.049" W (2.00mm x 1.25mm); Height - Seated (Max): -; Thickness (Max): 0.057" (1.45mm); Lead Spacing: -; Lead Style: -
C26 C28-C33 = GRM219R71E104KA01D: as C38 on sheet CAN; Datasheets: http://www.murata.com/~/media/webrenewal/support/library/catalog/products/capacitor/mlcc/c02e.pdf; Image: //media.digikey.com/Renders/Murata%20Renders/0805%20(2012%20Metric)%20.85mm.jpg; Digi-Key Part Number: 490-12754-1-ND; Part Number: GRM219R71E104KA01D; Quantity Available: 8594; @ qty: 0; Packaging: Cut Tape (CT); Series: GRM; Part Status: Active; Value: 0.10µF; Voltage: 25V; Temperature Coefficient: X7R; Operating Temperature: -55°C ~ 125°C; Features: -; Ratings: -; Applications: General Purpose; Mounting Type: Surface Mount, MLCC; Package / Case: 0805 (2012 Metric); Size / Dimension: 0.079" L x 0.049" W (2.00mm x 1.25mm); Height - Seated (Max): -; Thickness (Max): 0.037" (0.95mm); Lead Spacing: -; Lead Style: -
C27 C34 = GCJ21BR71A106KE01L: CAP CER 10UF 10V X7R 0805; Manufacturer: Murata Electronics North America; Factory Stock: 0; Unit Price (USD): 0.56; Minimum Quantity: 1; Tolerance: ±10%; Datasheets: http://www.murata.com/~/media/webrenewal/support/library/catalog/products/capacitor/mlcc/c03e.ashx; Image: //media.digikey.com/Renders/Murata%20Renders/0805%20(2012%20Metric)%20.85mm.jpg; Digi-Key Part Number: 490-12646-1-ND; Part Number: GCJ21BR71A106KE01L; Quantity Available: 2702; @ qty: 0; Packaging: Cut Tape (CT); Series: GCJ; Part Status: Active; Value: 10µF; Voltage: 10V; Temperature Coefficient: X7R; Operating Temperature: -55°C ~ 125°C; Features: Soft Termination; Ratings: AEC-Q200; Applications: Automotive, Boardflex Sensitive; Mounting Type: Surface Mount, MLCC; Package / Case: 0805 (2012 Metric); Size / Dimension: 0.079" L x 0.049" W (2.00mm x 1.25mm); Height - Seated (Max): -; Thickness (Max): 0.057" (1.45mm); Lead Spacing: -; Lead Style: -
C35 C36 = GQM2195C2A180JB01D: CAP CER 18PF 100V NP0 0805; Manufacturer: Murata Electronics North America; Factory Stock: 0; Unit Price (USD): 0.91; Minimum Quantity: 1; Tolerance: ±5%; Temperature Coefficient: C0G, NP0; Datasheets: http://www.murata.com/~/media/webrenewal/support/library/catalog/products/capacitor/mlcc/c02e.pdf; Image: //media.digikey.com/Renders/Murata%20Renders/0805(GxM9).jpg; Digi-Key Part Number: 490-3606-1-ND; Part Number: GQM2195C2A180JB01D; Quantity Available: 8724; @ qty: 0; Packaging: Cut Tape (CT); Series: GQM; Part Status: Active; Value: 18pF; Voltage: 100V; Operating Temperature: -55°C ~ 125°C; Features: High Q, Low Loss; Ratings: -; Applications: RF, Microwave, High Frequency; Mounting Type: Surface Mount, MLCC; Package / Case: 0805 (2012 Metric); Size / Dimension: 0.079" L x 0.049" W (2.00mm x 1.25mm); Height - Seated (Max): -; Thickness (Max): 0.037" (0.95mm); Lead Spacing: -; Lead Style: -
Ethernet1 = HR911105A: HR911105A Ethernet Interface Arduino Platform Evaluation Expansion Board; MF: DFRobot; Package: None; Availability: Unavailable; MP: HR911105A; Value: *; SnapEDA_Link: https://www.snapeda.com/parts/HR911105A/DFRobot/view-part/214807/?ref=snap; Price: None
L2 = IND0805_WURTH_742792022: Inductor; Part Description: SMD EMI Suppression Chip Ferrite Bead (WE-CBF Serie); Manufacturer: WURTH ELEKTRONIK; Value: 220R@100MHz; Power: 2A; Resistance: 0.05R; Tolerance: ±25%; Table: Inductors SMD; Part Number: IND0805_WURTH_742792022; Component Kind: Standard; Component Type: Standard; Footprint: INDC2012X110N; Pin Count: 2; Status: None; Manufacturer Part Number: 742792022; Case: 0805; Mounted: Yes; Socket: No; SMD: Yes; ComponentHeight: 1.1mm; HelpURL: \\cern.ch\dfs\Applications\Altium\Datasheets\IND0805_WURTH_742792022.pdf; Author: CERN DEM JLC; CreateDate: 5/5/2009; LatestRevisionDate: 12/2/2009
R15 R16 R20 R22 = ERJ-6ENF49R9V: RES SMD 49.9 OHM 1% 1/8W 0805; Manufacturer: Panasonic Electronic Components; Factory Stock: 0; Unit Price (USD): 0.00729; @ qty: 1500; Minimum Quantity: 1; Power (Watts): 0.125W, 1/8W; Temperature Coefficient: ±100ppm/°C; Part Number: ERJ-6ENF49R9V; Datasheets: http://industrial.panasonic.com/www-cgi/jvcr13pz.cgi?E+PZ+3+AOA0002+ERJ6ENF49R9V+7+WW; Image: //media.digikey.com/Renders/Panasonic%20Renders/ERJ-0805%20Pkg.jpg; Digi-Key Part Number: P49.9CCT-ND; Quantity Available: 574999; Packaging: Cut Tape (CT); Series: ERJ; Part Status: Active; Value: 49.9; Tolerance: ±1%; Composition: Thick Film; Features: Automotive AEC-Q200; Operating Temperature: -55°C ~ 155°C; Package / Case: 0805 (2012 Metric); Supplier Device Package: 0805; Size / Dimension: 0.079" L x 0.049" W (2.00mm x 1.25mm); Height - Seated (Max): 0.028" (0.70mm); Number of Terminations: 2; Failure Rate: -
R17-R19 R23 R24 R41 = ERJ-6ENF33R0V: RES SMD 33 OHM 1% 1/8W 0805; Manufacturer: Panasonic Electronic Components; Factory Stock: 0; Unit Price (USD): 0.00729; @ qty: 1500; Minimum Quantity: 1; Value: 33; Power (Watts): 0.125W, 1/8W; Temperature Coefficient: ±100ppm/°C; Part Number: ERJ-6ENF33R0V; Datasheets: http://industrial.panasonic.com/www-cgi/jvcr13pz.cgi?E+PZ+3+AOA0002+ERJ6ENF33R0V+7+WW; Image: //media.digikey.com/Renders/Panasonic%20Renders/ERJ-0805%20Pkg.jpg; Digi-Key Part Number: P33.0CCT-ND; Quantity Available: 96423; Packaging: Cut Tape (CT); Series: ERJ; Part Status: Active; Tolerance: ±1%; Composition: Thick Film; Features: Automotive AEC-Q200; Operating Temperature: -55°C ~ 155°C; Package / Case: 0805 (2012 Metric); Supplier Device Package: 0805; Size / Dimension: 0.079" L x 0.049" W (2.00mm x 1.25mm); Height - Seated (Max): 0.028" (0.70mm); Number of Terminations: 2; Failure Rate: -
R21 = ERJ-6ENF10R0V: RES SMD 10 OHM 1% 1/8W 0805; Manufacturer: Panasonic Electronic Components; Factory Stock: 0; Unit Price (USD): 0.00729; @ qty: 1500; Minimum Quantity: 1; Power (Watts): 0.125W, 1/8W; Temperature Coefficient: ±100ppm/°C; Part Number: ERJ-6ENF10R0V; Datasheets: http://industrial.panasonic.com/www-cgi/jvcr13pz.cgi?E+PZ+3+AOA0002+ERJ6ENF10R0V+7+WW; Image: //media.digikey.com/Renders/Panasonic%20Renders/ERJ-0805%20Pkg.jpg; Digi-Key Part Number: P10.0CCT-ND; Quantity Available: 190988; Packaging: Cut Tape (CT); Series: ERJ; Part Status: Active; Value: 10; Tolerance: ±1%; Composition: Thick Film; Features: Automotive AEC-Q200; Operating Temperature: -55°C ~ 155°C; Package / Case: 0805 (2012 Metric); Supplier Device Package: 0805; Size / Dimension: 0.079" L x 0.049" W (2.00mm x 1.25mm); Height - Seated (Max): 0.028" (0.70mm); Number of Terminations: 2; Failure Rate: -
R25-R28 = ERJ-6ENF33R0V: RES SMD 33 OHM 1% 1/8W 0805; Manufacturer: Panasonic Electronic Components; Factory Stock: 0; Unit Price (USD): 0.00729; @ qty: 1500; Minimum Quantity: 1; Power (Watts): 0.125W, 1/8W; Temperature Coefficient: ±100ppm/°C; Part Number: ERJ-6ENF33R0V; Datasheets: http://industrial.panasonic.com/www-cgi/jvcr13pz.cgi?E+PZ+3+AOA0002+ERJ6ENF33R0V+7+WW; Image: //media.digikey.com/Renders/Panasonic%20Renders/ERJ-0805%20Pkg.jpg; Digi-Key Part Number: P33.0CCT-ND; Quantity Available: 96423; Packaging: Cut Tape (CT); Series: ERJ; Part Status: Active; Value: 33; Tolerance: ±1%; Composition: Thick Film; Features: Automotive AEC-Q200; Operating Temperature: -55°C ~ 155°C; Package / Case: 0805 (2012 Metric); Supplier Device Package: 0805; Size / Dimension: 0.079" L x 0.049" W (2.00mm x 1.25mm); Height - Seated (Max): 0.028" (0.70mm); Number of Terminations: 2; Failure Rate: -
R29 = ERJ-6ENF1242V: RES SMD 12.4K OHM 1% 1/8W 0805; Manufacturer: Panasonic Electronic Components; Factory Stock: 0; Unit Price (USD): 0.00729; @ qty: 1500; Minimum Quantity: 1; Power (Watts): 0.125W, 1/8W; Temperature Coefficient: ±100ppm/°C; Part Number: ERJ-6ENF1242V; Datasheets: http://industrial.panasonic.com/www-cgi/jvcr13pz.cgi?E+PZ+3+AOA0002+ERJ6ENF1242V+7+WW; Image: //media.digikey.com/Renders/Panasonic%20Renders/ERJ-0805%20Pkg.jpg; Digi-Key Part Number: P12.4KCCT-ND; Quantity Available: 46459; Packaging: Cut Tape (CT); Series: ERJ; Part Status: Active; Value: 12.4k; Tolerance: ±1%; Composition: Thick Film; Features: Automotive AEC-Q200; Operating Temperature: -55°C ~ 155°C; Package / Case: 0805 (2012 Metric); Supplier Device Package: 0805; Size / Dimension: 0.079" L x 0.049" W (2.00mm x 1.25mm); Height - Seated (Max): 0.028" (0.70mm); Number of Terminations: 2; Failure Rate: -
R30 = ERJ-6ENF1001V: RES SMD 1K OHM 1% 1/8W 0805; Manufacturer: Panasonic Electronic Components; Factory Stock: 0; Unit Price (USD): 0.00729; @ qty: 1500; Minimum Quantity: 1; Power (Watts): 0.125W, 1/8W; Temperature Coefficient: ±100ppm/°C; Part Number: ERJ-6ENF1001V; Datasheets: http://industrial.panasonic.com/www-cgi/jvcr13pz.cgi?E+PZ+3+AOA0002+ERJ6ENF1001V+7+WW; Image: //media.digikey.com/Renders/Panasonic%20Renders/ERJ-0805%20Pkg.jpg; Digi-Key Part Number: P1.00KCCT-ND; Quantity Available: 12895103; Packaging: Cut Tape (CT); Series: ERJ; Part Status: Active; Value: 1k; Tolerance: ±1%; Composition: Thick Film; Features: Automotive AEC-Q200; Operating Temperature: -55°C ~ 155°C; Package / Case: 0805 (2012 Metric); Supplier Device Package: 0805; Size / Dimension: 0.079" L x 0.049" W (2.00mm x 1.25mm); Height - Seated (Max): 0.028" (0.70mm); Number of Terminations: 2; Failure Rate: -
R31 R32 = ERJ-6GEYJ331V: as R2 on sheet MCU; Part Number: ERJ-6GEYJ331V; Datasheets: http://industrial.panasonic.com/www-cgi/jvcr13pz.cgi?E+PZ+3+AOA0001+ERJ6GEYJ331V+7+WW; Image: //media.digikey.com/Renders/Panasonic%20Renders/ERJ-0805%20Pkg.jpg; Digi-Key Part Number: P330ACT-ND; Quantity Available: 212236; Packaging: Cut Tape (CT); Series: ERJ; Part Status: Active; Value: 330; Tolerance: ±5%; Composition: Thick Film; Features: Automotive AEC-Q200; Operating Temperature: -55°C ~ 155°C; Package / Case: 0805 (2012 Metric); Supplier Device Package: 0805; Size / Dimension: 0.079" L x 0.049" W (2.00mm x 1.25mm); Height - Seated (Max): 0.028" (0.70mm); Number of Terminations: 2; Failure Rate: -
R33 = ERJ-6ENF1004V: RES SMD 1M OHM 1% 1/8W 0805; Manufacturer: Panasonic Electronic Components; Factory Stock: 0; Unit Price (USD): 0.00729; @ qty: 1500; Minimum Quantity: 1; Power (Watts): 0.125W, 1/8W; Temperature Coefficient: ±100ppm/°C; Part Number: ERJ-6ENF1004V; Datasheets: http://industrial.panasonic.com/www-cgi/jvcr13pz.cgi?E+PZ+3+AOA0002+ERJ6ENF1004V+7+WW; Image: //media.digikey.com/Renders/Panasonic%20Renders/ERJ-0805%20Pkg.jpg; Digi-Key Part Number: P1.00MCCT-ND; Quantity Available: 710452; Packaging: Cut Tape (CT); Series: ERJ; Part Status: Active; Value: 1M; Tolerance: ±1%; Composition: Thick Film; Features: Automotive AEC-Q200; Operating Temperature: -55°C ~ 155°C; Package / Case: 0805 (2012 Metric); Supplier Device Package: 0805; Size / Dimension: 0.079" L x 0.049" W (2.00mm x 1.25mm); Height - Seated (Max): 0.028" (0.70mm); Number of Terminations: 2; Failure Rate: -
R34-R39 = ERJ-6ENF1002V: RES SMD 10K OHM 1% 1/8W 0805; Manufacturer: Panasonic Electronic Components; Factory Stock: 0; Unit Price (USD): 0.00729; @ qty: 1500; Minimum Quantity: 1; Power (Watts): 0.125W, 1/8W; Temperature Coefficient: ±100ppm/°C; Part Number: ERJ-6ENF1002V; Datasheets: http://industrial.panasonic.com/www-cgi/jvcr13pz.cgi?E+PZ+3+AOA0002+ERJ6ENF1002V+7+WW; Image: //media.digikey.com/Renders/Panasonic%20Renders/ERJ-0805%20Pkg.jpg; Digi-Key Part Number: P10.0KCCT-ND; Quantity Available: 3985614; Packaging: Cut Tape (CT); Series: ERJ; Part Status: Active; Value: 10k; Tolerance: ±1%; Composition: Thick Film; Features: Automotive AEC-Q200; Operating Temperature: -55°C ~ 155°C; Package / Case: 0805 (2012 Metric); Supplier Device Package: 0805; Size / Dimension: 0.079" L x 0.049" W (2.00mm x 1.25mm); Height - Seated (Max): 0.028" (0.70mm); Number of Terminations: 2; Failure Rate: -
U6 = W5500: Socket Contact Silver 17-20 AWG Crimp Power; MF: WIZnet; Price: None; Package: LQFP-48 WIZnet; Value: *; MP: W5500; Availability: Unavailable; SnapEDA_Link: https://www.snapeda.com/parts/W5500/WIZnet/view-part/45250/?ref=snap
XTAL2 = XTAL: as XTAL1 on sheet MCU; Design Date: 2017-1-3; ComponentLink1Description: Datasheet; ComponentLink2Description: Reference; Mounting Technology: Surface Mount\Through-Hole; Status: Unreleased

## Sheet POWER.SchDoc
size A
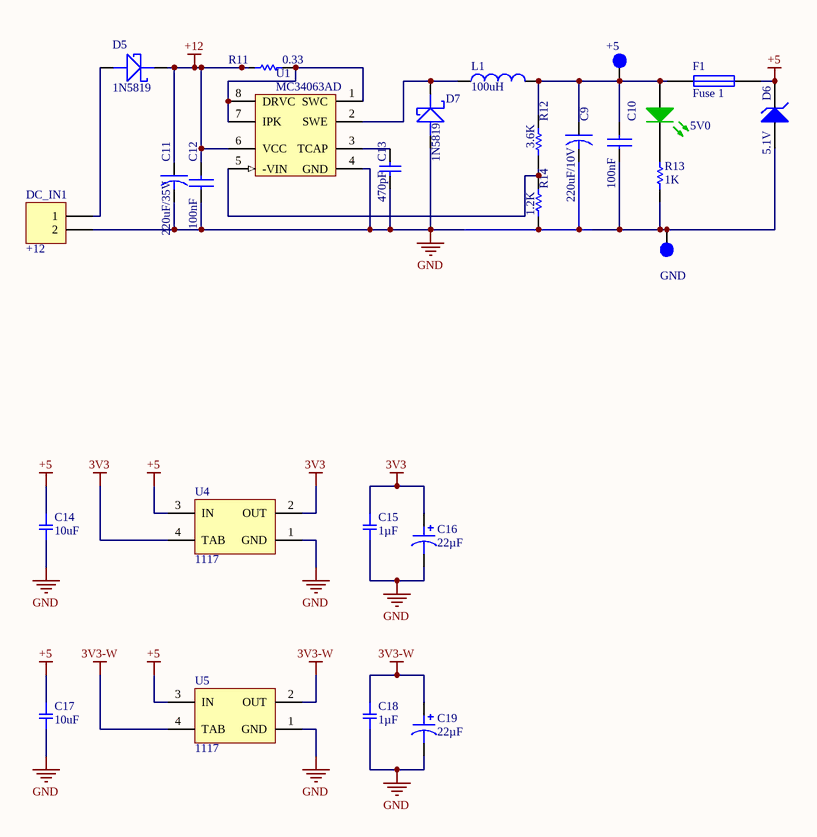
[diagram p5: POWER.SchDoc]

### Parts
5V0  LED-GREEN  [DIOSMD1206]  (value not drawn)
+5  Test Point  [PIN1]  (value not drawn)  (no BOM)
C9  220uF/10V  [Radial-B8]
C10  100nF  [0805]
C11  220uF/35V  [Radial-C10]
C12  100nF  [0805]
C13  470pF  [0805]
C14  10uF  [0805]
C15  1µF  [0805]
C16  22µF  [3216[1206]]
C17  10uF  [0805]
C18  1µF  [0805]
C19  22µF  [3216[1206]]
D5  1N5819  [DIODE-SMA]
D6  5.1V  [DIODE-SMA]
D7  1N5819  [DIODE-SMA]
DC_IN1  +12  [Phoenix_2]
F1  Fuse 1  [3216[1206]]
GND  Test Point  [PIN1]  (value not drawn)  (no BOM)
L1  100uH  [L_Right]
R11  0.33  [1206]
R12  3.6K  [0805]
R13  1K  [0805]
R14  1.2K  [0805]
U1  MC34063AD  [soic-8]
U4  1117  [SOT223]
U5  1117  [SOT223]

### Nets
3V3: C15.1 C16.1 U4.2(OUT) U4.4(TAB)
3V3-W: C18.1 C19.1 U5.2(OUT) U5.4(TAB)
+5: C14.1 C17.1 D6.2(K) F1.2 U4.3(IN) U5.3(IN)
+12: C11.1 C12.2 D5.2(K) R11.2 U1.6(VCC)
GND: C9.2 C10.1 C11.2 C12.1 C13.2 C14.2 C15.2 C16.2 C17.2 C18.2 C19.2 D6.1(A) D7.1(A) DC_IN1.2 GND.1 R13.2 R14.1 U1.4(GND) U4.1(GND) U5.1(GND)
Net5V0_1: 5V0.1(A) +5.1 C9.1 C10.2 F1.1 L1.2 R12.2
Net5V0_2: 5V0.2(K) R13.1
NetC13_1: C13.1 U1.3(TCAP)
NetD5_1: D5.1(A) DC_IN1.1
NetD7_2: D7.2(K) L1.1 U1.2(SWE)
NetR11_1: R11.1 U1.1(SWC) U1.7(IPK) U1.8(DRVC)
NetR12_1: R12.1 R14.2 U1.5(-VIN)

### Library data of the parts
5V0 = LED-GREEN: General Propuse Ga/As LED
+5 GND = Test Point: No PCB Compunent need; Signal: Voltage
C9 C11 = CAPACITOR: Electrolytic Capacitor
C10 C12 = C: 63V Multilayer
C13 = Cap: Capacitor; Value: 100pF; Published: 8-Jun-2000; LatestRevisionDate: 17-Jul-2002; LatestRevisionNote: Re-released for DXP Platform.; PackageReference: RAD-0.3; Publisher: Altium Limited
C14 C17 = GCM219R71C105KA37J: CAP CER 1.0UF 16V X7R 0805; Manufacturer: Murata Electronics North America; Factory Stock: 0; Unit Price (USD): 0.17; Minimum Quantity: 1; Value: 1µF; Tolerance: ±10%; Datasheets: http://www.murata.com/~/media/webrenewal/support/library/catalog/products/capacitor/mlcc/c03e.ashx; Image: //media.digikey.com/photos/Murata%20Photos/NCP,GCM%20SERIES%200805.jpg; Digi-Key Part Number: 490-12590-1-ND; Part Number: GCM219R71C105KA37J; Quantity Available: 7483; @ qty: 0; Packaging: Cut Tape (CT); Series: GCM; Part Status: Active; Voltage: 16V; Temperature Coefficient: X7R; Operating Temperature: -55°C ~ 125°C; Features: -; Ratings: AEC-Q200; Applications: Automotive; Mounting Type: Surface Mount, MLCC; Package / Case: 0805 (2012 Metric); Size / Dimension: 0.079" L x 0.049" W (2.00mm x 1.25mm); Height - Seated (Max): 0.037" (0.95mm); Thickness (Max): -; Lead Spacing: -
C15 C18 = GRM21BR71A105KA01K: CAP CER 1UF 10V X7R 0805; Manufacturer: Murata Electronics North America; Factory Stock: 0; Unit Price (USD): 0.11; Minimum Quantity: 1; Tolerance: ±10%; Datasheets: http://www.murata.com/~/media/webrenewal/support/library/catalog/products/capacitor/mlcc/c02e.pdf; Image: //media.digikey.com/Renders/Murata%20Renders/0805%20(2012%20Metric)%20.85mm.jpg; Digi-Key Part Number: 490-11595-1-ND; Part Number: GRM21BR71A105KA01K; Quantity Available: 16620; @ qty: 0; Packaging: Cut Tape (CT); Series: GRM; Part Status: Active; Value: 1µF; Voltage: 10V; Temperature Coefficient: X7R; Operating Temperature: -55°C ~ 125°C; Features: -; Ratings: -; Applications: General Purpose; Mounting Type: Surface Mount, MLCC; Package / Case: 0805 (2012 Metric); Size / Dimension: 0.079" L x 0.049" W (2.00mm x 1.25mm); Height - Seated (Max): -; Thickness (Max): 0.053" (1.35mm); Lead Spacing: -; Lead Style: -
C16 C19 = F931A226KAA: CAP TANT 22UF 10% 10V 1206; Manufacturer: AVX Corporation; Manufacturer Size Code: A; ESR (Equivalent Series Resistance): 2.5Ohm @ 100kHz; Lifetime @ Temp.: 2000 Hrs @ 125°C; Type: Molded; Part Number: F931A226KAA; Value: 22µF; Capacitance: 22µF; ComponentLink1Description: Datasheet; ComponentLink1URL: http://datasheets.avx.com/F93.pdf; ComponentLink2Description: DigiKey Link; ComponentLink2URL: http://digikey.com/product-detail/en/avx-corporation/F931A226KAA/478-8208-1-ND/4005605; Device Package: 1206 (3216 Metric); Features: General Purpose; Height - Seated (Max): 0.071" (1.80mm); LastUpdated: 1/21/2020 1:56:38 AM; Lifecycle Status: Active; Minimum Order: 1; Mounting Type: Surface Mount; Operating Temperature: -55°C ~ 125°C; Package / Case: 1206 (3216 Metric); Packaging: TapeAndReel; PartId: 182; Part Status: Active; Price: 0.14; Series: F93; Size / Dimension: 0.126" L x 0.063" W (3.20mm x 1.60mm); Supplier 1: DigiKey; Supplier Part Number 1: 478-8208-1-ND; Tolerance: ±10%; Voltage - Rated: 10V
D5 D7 = DIODE SCHOTTKY: Schottky Diode
D6 = D Zener: Zener Diode; Published: 8-Jun-2000; LatestRevisionDate: 17-Jul-2002; LatestRevisionNote: Re-released for DXP Platform.; PackageReference: DIODE-0.7; Publisher: Altium Limited; PackageDescription: Diode, Thru-Hole; 2 Leads; 0.7 in Pin Spacing
DC_IN1 = Header 2: Header, 2-Pin; LatestRevisionDate: 17-Jul-2002; LatestRevisionNote: Re-released for DXP Platform.; Publisher: Altium Limited
F1 = Fuse 1: Fuse; Published: 8-Jun-2000; LatestRevisionDate: 17-Jul-2002; LatestRevisionNote: Re-released for DXP Platform.; PackageReference: PIN-W2/E2.8; Publisher: Altium Limited; PackageDescription: Thru-Hole; 2 Leads
L1 = INDUCTOR
R11 = Res1: Resistor; Published: 8-Jun-2000; LatestRevisionDate: 17-Jul-2002; LatestRevisionNote: Re-released for DXP Platform.; PackageReference: AXIAL-0.3; Publisher: Altium Limited; Value: 0.33
R12 = Res1: Resistor; Value: 1.2K; Published: 8-Jun-2000; LatestRevisionDate: 17-Jul-2002; LatestRevisionNote: Re-released for DXP Platform.; PackageReference: AXIAL-0.3; Publisher: Altium Limited
R13 = 1-ResistorW: Resistor
R14 = Res1: Resistor; Value: ?K; Published: 8-Jun-2000; LatestRevisionDate: 17-Jul-2002; LatestRevisionNote: Re-released for DXP Platform.; PackageReference: AXIAL-0.3; Publisher: Altium Limited
U1 = MC34063AD: DC-to-DC Converter Control Circuit; Published: 17-Jul-2002; LatestRevisionDate: 13-Apr-2006; LatestRevisionNote: IPC-7351 Footprint Added.; DatasheetVersion: 1988; PackageReference: 751-02; Publisher: Altium Limited; PackageDescription: 8-Pin Small Outline Integrated Circuit 1.27 mm Pitch; Code_JEDEC: MS-012-AA; Code_IPC: SOIC127P600-8; ComponentLink1Description: Manufacturer Link; ComponentLink1URL: http://www.onsemi.com/site/products/taxonomy/0,4438,503,00.html; ComponentLink2Description: Datasheet; ComponentLink2URL: http://www.onsemi.com/pub/Collateral/MC34063A-D.PDF
U4 U5 = AMS1117-x.x: x.x Volt, 800mA Low-Dropout Linear Regulator, 4-pin SOT-223; Designer: Ali Hafizi; Data: 16-12-2016

## Sheet RS485.SchDoc
size A
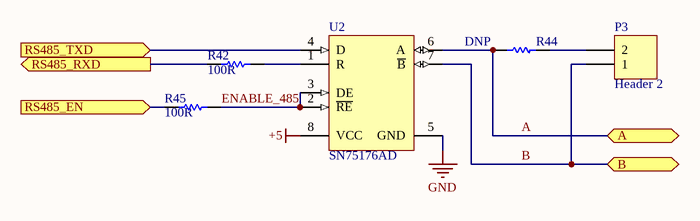
[diagram p6: RS485.SchDoc]

### Parts
P3  Header 2  [HDR1X2]
R42  100R  [0805]
R44  DNP  [0805]
R45  100R  [0805]
U2  SN75176AD  [soic-8]

### Ports
A (bidir), B (bidir), RS485_EN (in), RS485_RXD (out), RS485_TXD (in)

### Nets
+5: U2.8(VCC)
GND: U2.5(GND)
A: R44.2 U2.6(A) ; port A
B: P3.1 U2.7(~{B}) ; port B
ENABLE_485: R45.2 U2.2(~{RE}) U2.3(DE)
NetP3_2: P3.2 R44.1
NetR42_1: R42.1 ; port RS485_RXD
NetR42_2: R42.2 U2.1(R)
NetR45_1: R45.1 ; port RS485_EN
NetU2_4: U2.4(D) ; port RS485_TXD

### Library data of the parts
P3 = Header 2: Header, 2-Pin; LatestRevisionDate: 17-Jul-2002; LatestRevisionNote: Re-released for DXP Platform.; Publisher: Altium Limited
R42 R45 = Resistor_SMD: Resistor; Value: 200R; Telorance: 5%; Power: 0.125W; Supplier 1: Digi-Key; Supplier 2: Newark; Supplier 3: Farnell; Supplier Part Number 1: 311-1.0KARCT-ND; Supplier Part Number 2: 68R0253; Supplier Part Number 3: 2413776
R44 = 1-ResistorW: Resistor
U2 = SN75176AD: Differential Bus Transceiver, 1 TX / 1 RX, 5V, 0 to 70 degC, 8-Pin SOIC (D), Green (RoHS & no Sb/Br); Manufacturer: Texas Instruments; SubFamily: RS-422; Drivers Per Package: 1; ICC(Max)(mA): 50; Supply Voltage(s)(V): 5; ESD(kV): 2; Rating: Catalog; DatasheetVersion: SLLS100A; PackageVersion: revM, Jun-2011; PackageReference: D8; PackageDescription: 8-Pin Plastic Small Outline Integrated Circuit, 4.9 x 3.9 mm, Pitch 1.27 mm Pitch; PartNumber: SN75176AD; Mounting Technology: Surface Mount; Eco-Plan: Green (RoHS & no Sb/Br); Receivers Per Package: 1; # of TX/RX: 1 TX / 1 RX; Footprint: SN75176; Isolated: No; Code_JEDEC: MS-012AA; ComponentLink1Description: Datasheet; ComponentLink1URL: http://www.ti.com/general/docs/lit/getliterature.tsp?genericPartNumber=SN75176A&fileType=pdf; ComponentLink2Description: Package Specification; ComponentLink2URL: http://www.ti.com/lit/ml/msoi002j/msoi002j.pdf

## Nets that join several sheets
3V3: MCU (11 pins), IO (P2.1), POWER (C15.1 C16.1 U4.2 U4.4)
3V3-W: ETHERNET (9 pins), POWER (C18.1 C19.1 U5.2 U5.4)
+5: CAN (C37.1 C38.1 MCP1.3), MCU (LED1.1 LED2.1 LED3.1 LED4.1), POWER (6 pins), RS485 (U2.8)
+12: IO (F2.1), POWER (5 pins)
GND: CAN (C37.2 C38.2 MCP1.2 MCP1.8), MCU (18 pins), IO (P2.3 STD_CAN1.3 UART1.1), ETHERNET (30 pins), POWER (20 pins), RS485 (U2.5)
A: IO (P1.1), RS485 (R44.2 U2.6)
B: IO (P1.3), RS485 (P3.1 U2.7)
CAN_N: CAN (MCP1.6 R40.1), IO (STD_CAN1.2)
CAN_P: CAN (MCP1.7 R40.2), IO (STD_CAN1.7)
CAN_RXD: CAN (R47.2), MCU (U3.32)
CAN_TXD: CAN (R46.2), MCU (U3.33)
JTCK SWCLK PA14: MCU (U3.37), IO (P2.2)
JTMS SWDIO PA13: MCU (U3.34), IO (P2.4)
NetR17_1: MCU (U3.20), ETHERNET (R17.1)
NetR18_1: MCU (U3.17), ETHERNET (R18.1)
NetR19_1: MCU (U3.16), ETHERNET (R19.1)
NetR23_1: MCU (U3.15), ETHERNET (R23.1)
NetR24_1: MCU (U3.18), ETHERNET (R24.1)
NetR41_1: MCU (U3.19), ETHERNET (R41.1)
NetR42_1: MCU (U3.31), RS485 (R42.1)
NetR45_1: MCU (U3.29), RS485 (R45.1)
NetU2_4: MCU (U3.30), RS485 (U2.4)
NetU3_21: MCU (U3.21), IO (UART1.2)
NetU3_22: MCU (U3.22), IO (UART1.3)
NRST: MCU (R6.1 RST1.2 U3.7), IO (P2.5)